# Altium schematic sheet converter.SchDoc
size A3
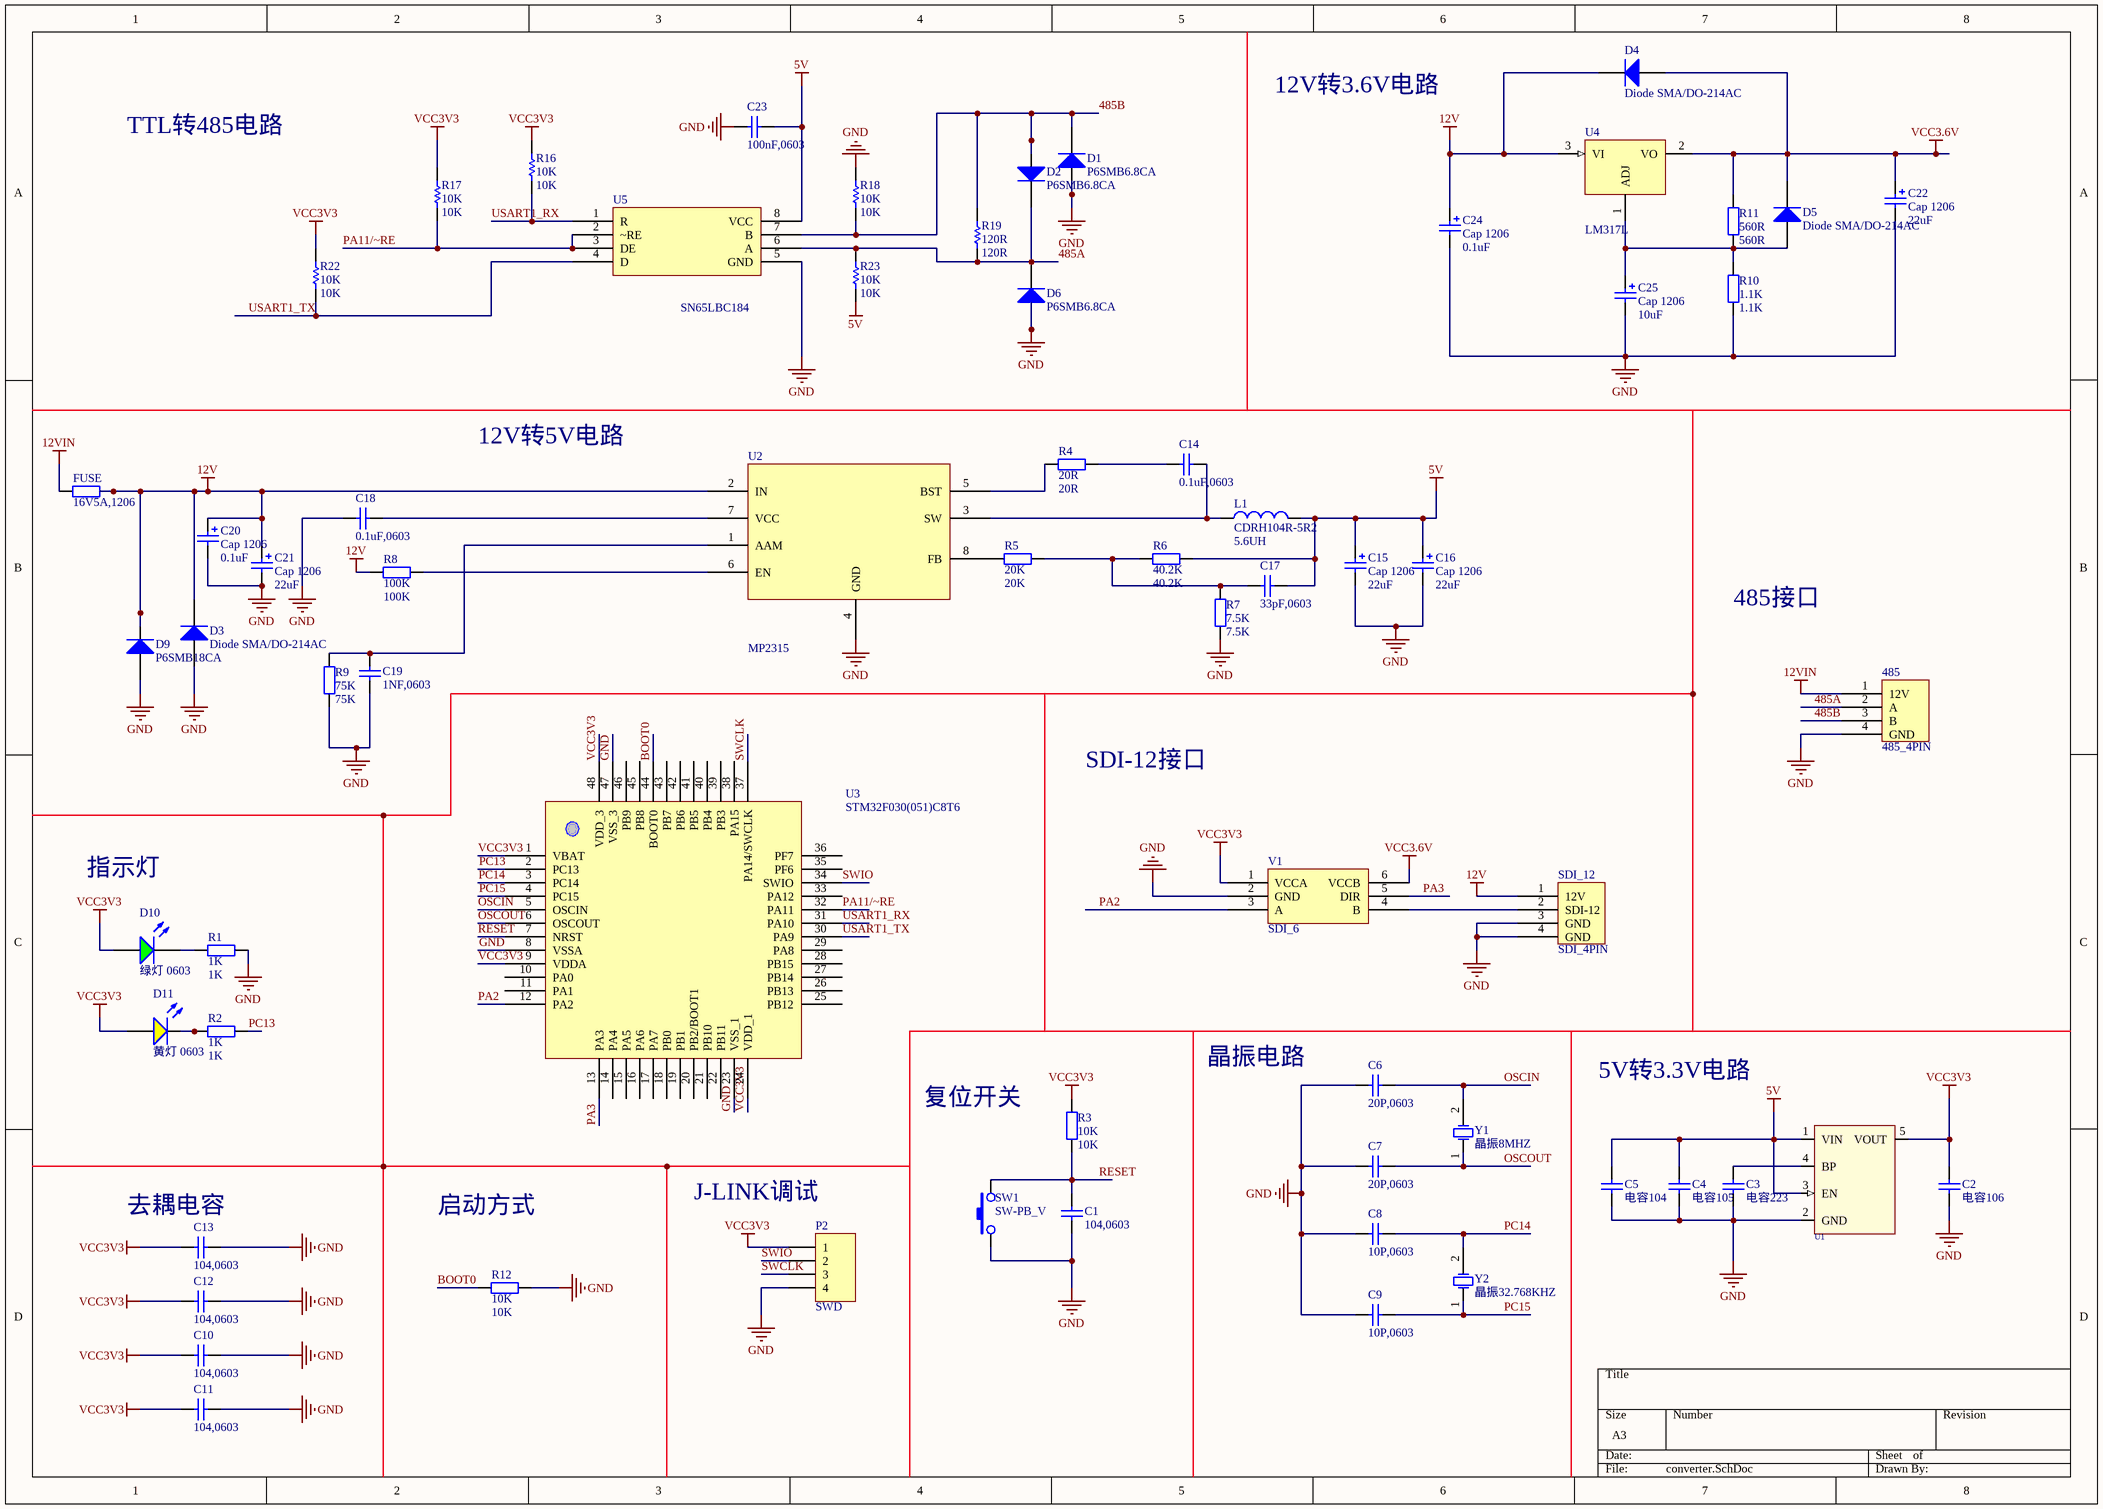
[diagram p0: converter.SchDoc]

## Parts
485  485_4PIN  [HDR1X4]
C1  104,0603  [C0603]
C2  电容106  [C0603]
C3  电容223  [C0603]
C4  电容105  [C0603]
C5  电容104  [C0603]
C6  20P,0603  [C0603]
C7  20P,0603  [C0603]
C8  10P,0603  [C0603]
C9  10P,0603  [C0603]
C10  104,0603  [C0603]
C11  104,0603  [C0603]
C12  104,0603  [C0603]
C13  104,0603  [C0603]
C14  0.1uF,0603  [C0603]
C15  Cap 1206  value 22uF  [LC-1206+]
C16  Cap 1206  value 22uF  [LC-1206+]
C17  33pF,0603  [C0603]
C18  0.1uF,0603  [C0603]
C19  1NF,0603  [C0603]
C20  Cap 1206  value 0.1uF  [LC-1206+]
C21  Cap 1206  value 22uF  [LC-1206+]
C22  Cap 1206  value 22uF  [LC-1206+]
C23  100nF,0603  [C0603]
C24  Cap 1206  value 0.1uF  [LC-1206+]
C25  Cap 1206  value 10uF  [LC-1206+]
D1  P6SMB6.8CA  [LC-SMB(DO-214AA)_S1]
D2  P6SMB6.8CA  [LC-SMB(DO-214AA)_S1]
D3  Diode SMA/DO-214AC  [LC-SMA(DO-214AC)_S1]
D4  Diode SMA/DO-214AC  [LC-SMA(DO-214AC)_S1]
D5  Diode SMA/DO-214AC  [LC-SMA(DO-214AC)_S1]
D6  P6SMB6.8CA  [LC-SMB(DO-214AA)_S1]
D9  P6SMB18CA  [LC-SMB(DO-214AA)_S1]
D10  绿灯 0603  [LC-0603_LED_S1]
D11  黄灯 0603  [LC-0603_LED_S1]
FUSE  16V5A,1206  [LC-1206_R]
L1  CDRH104R-5R2  value 5.6UH  [SMD]
P2  SWD  [HDR1X4]
R1  1K  [LC-0603_R]
R2  1K  [LC-0603_R]
R3  10K  [LC-0603_R]
R4  20R  [LC-0603_R]
R5  20K  [LC-0603_R]
R6  40.2K  [LC-0603_R]
R7  7.5K  [LC-0603_R]
R8  100K  [LC-0603_R]
R9  75K  [LC-0603_R]
R10  1.1K  [LC-0603_R]
R11  560R  [LC-0603_R]
R12  10K  [LC-0603_R]
R16  10K  [LC-0603_R]
R17  10K  [LC-0603_R]
R18  10K  [LC-0603_R]
R19  120R  [LC-0603_R]
R22  10K  [LC-0603_R]
R23  10K  [LC-0603_R]
SDI_12  SDI_4PIN  [HDR1X4]
SW1  SW-PB_V  [3.8*6.1微动开关]
U1  RT9193  [SOT-23-5]  (value not drawn)
U2  MP2315  [TSOT23-8]
U3  STM32F030(051)C8T6  [48P]
U4  LM317L  [TO-92-0.6]
U5  SN65LBC184  [SO8_N]
V1  SDI_6  [SOT23-6_L]
Y1  晶振8MHZ  [LC-SMD-5032_2P]
Y2  晶振32.768KHZ  [LC-SMD-3215_2P FC - 135]

## Nets
5V: C4.2 C5.2 C15.1 C16.1 C17.2 C23.1 L1.2 R6.1 R23.1 U1.1(VIN) U1.3(EN) U5.8(VCC)
12V: C20.1 C21.1 C24.1 D3.2(K) D4.2(K) D9.2(K) FUSE.2 R8.2 SDI_12.1(12V) U2.2(IN) U4.3(VI)
12VIN: 485.1(12V) FUSE.1
GND: 485.4(GND) C1.1 C2.1 C3.1 C4.1 C5.1 C6.1 C7.1 C8.1 C9.1 C10.2 C11.2 C12.2 C13.2 C15.2 C16.2 C18.2 C19.2 C20.2 C21.2 C22.2 C23.2 C24.2 C25.2 D1.1(A) D3.1(A) D6.1(A) D9.1(A) P2.4 R1.2 R7.1 R9.2 R10.2 R12.1 R18.2 SDI_12.3(GND) SDI_12.4(GND) SW1.1 U1.2(GND) U2.4(GND) U3.8(VSSA) U3.23(VSS_1) U3.47(VSS_3) U5.5(GND) V1.2(GND)
VCC3.6V: C22.1 D4.1(A) D5.2(K) R11.1 U4.2(VO) V1.6(VCCB)
VCC3V3: C2.2 C10.1 C11.1 C12.1 C13.1 D10.A D11.A P2.1 R3.2 R16.2 R17.2 R22.2 U1.5(VOUT) U3.1(VBAT) U3.9(VDDA) U3.24(VDD_1) U3.48(VDD_3) V1.1(VCCA)
485A: 485.2(A) D2.2(K) D6.2(K) R19.1 R23.2 U5.6(A)
485B: 485.3(B) D1.2(K) D2.1(A) R18.1 R19.2 U5.7(B)
BOOT0: R12.2 U3.44(BOOT0)
OSCIN: C6.2 U3.5(OSCIN) Y1.2(OSC2)
OSCOUT: C7.2 U3.6(OSCOUT) Y1.1(OSC1)
PA2: U3.12(PA2) V1.3(A)
PA3: U3.13(PA3) V1.5(DIR)
PA11/~RE: R17.1 U3.32(PA11) U5.2(~RE) U5.3(DE)
PC13: R2.2 U3.2(PC13)
PC14: C8.2 U3.3(PC14) Y2.2(OSC2)
PC15: C9.2 U3.4(PC15) Y2.1(OSC1)
RESET: C1.2 R3.1 SW1.2 U3.7(NRST)
SWCLK: P2.3 U3.37(PA14/SWCLK)
SWIO: P2.2 U3.34(SWIO)
USART1_RX: R16.1 U3.31(PA10) U5.1(R)
USART1_TX: R22.1 U3.30(PA9) U5.4(D)
NetC3_2: C3.2 U1.4(BP)
NetC14_1: C14.1 R4.1
NetC14_2: C14.2 L1.1 U2.3(SW)
NetC17_1: C17.1 R5.1 R6.2 R7.2
NetC18_1: C18.1 U2.7(VCC)
NetC19_1: C19.1 R9.1 U2.1(AAM)
NetC25_1: C25.1 D5.1(A) R10.1 R11.2 U4.1(ADJ)
NetD10_K: D10.K R1.1
NetD11_K: D11.K R2.1
NetR4_2: R4.2 U2.5(BST)
NetR5_2: R5.2 U2.8(FB)
NetR8_1: R8.1 U2.6(EN)
NetSDI_12_2: SDI_12.2(SDI-12) V1.4(B)

Not connected (* = marked no-connect by the designer): U3 10(PA0) 11(PA1) 14(PA4) 15(PA5) 16(PA6) 17(PA7) 18(PB0) 19(PB1) 20(PB2/BOOT1) 21(PB10) 22(PB11) 25(PB12) 26(PB13) 27(PB14) 28(PB15) 29(PA8) 33(PA12) 35(PF6) 36(PF7) 38(PA15) 39(PB3) 40(PB4) 41(PB5) 42(PB6) 43(PB7) 45(PB8) 46(PB9)

## Notes on the sheet
- 12V转3.6V电路
- TTL转485电路
- 12V转5V电路
- 485接口
- SDI-12接口
- 指示灯
- 复位开关
- 晶振电路
- 5V转3.3V电路
- (near C13) 去耦电容
- 启动方式
- (near P2) J-LINK调试

## Library data of the parts
C1-C14 C17-C19 C23 = Cap: Capacitor; Value: 104; Published: 8-Jun-2000; LatestRevisionDate: 17-Jul-2002; LatestRevisionNote: Re-released for DXP Platform.; Publisher: Altium Limited
C15 C16 C20-C22 C24 C25 = Cap Pol2: Polarized Capacitor (Axial); Published: 8-Jun-2000; LatestRevisionDate: 17-Jul-2002; LatestRevisionNote: Re-released for DXP Platform.; PackageReference: POLAR0.8; Publisher: Altium Limited; PackageDescription: Polarized Capacitor; 2 Leads
D1 D2 D6 D9 = SMB/DO-214AA P6SMB6.8CA: TVS; ComponentLink1Description: 供应商链接; ComponentLink1URL: http://www.szlcsc.com/product/details_79530.html; Package: SMB/DO-214AA; Supplier: LC; SuppliersPartNumber: C78395
D3 = Diode 1N4007: 1 Amp General Purpose Rectifier; Published: 8-Jun-2000; LatestRevisionDate: 17-Jul-2002; LatestRevisionNote: Re-released for DXP Platform.; DatasheetVersion: 1998; PackageVersion: Aug-1999; PackageReference: DO-41; Publisher: Altium Limited; PackageDescription: Diode, Axial; Body 5.2 x 2.7 mm (LxDia. max), Lead Dia. 0.86 mm (max); Code_JEDEC: DO-204-AL; ComponentLink1Description: Manufacturer Link; ComponentLink1URL: http://www.fairchildsemi.com/; ComponentLink2Description: Datasheet; ComponentLink2URL: http://www.fairchildsemi.com/ds/1N%2F1N4001.pdf
D4 D5 = Diode 1N4001: 1 Amp General Purpose Rectifier; Published: 8-Jun-2000; LatestRevisionDate: 17-Jul-2002; LatestRevisionNote: Re-released for DXP Platform.; DatasheetVersion: 1998; PackageVersion: Aug-1999; PackageReference: DO-41; Publisher: Altium Limited; PackageDescription: Diode, Axial; Body 5.2 x 2.7 mm (LxDia. max), Lead Dia. 0.86 mm (max); Code_JEDEC: DO-204-AL; ComponentLink1Description: Manufacturer Link; ComponentLink1URL: http://www.fairchildsemi.com/; ComponentLink2Description: Datasheet; ComponentLink2URL: http://www.fairchildsemi.com/ds/1N%2F1N4001.pdf
D10 = 0603 绿灯: 发光二极管; ComponentLink1Description: 供应商链接; ComponentLink1URL: http://www.szlcsc.com/product/details_73152.html; Package: 0603; Supplier: LC; SuppliersPartNumber: C72043
D11 = 0603 黄灯: 发光二极管; ComponentLink1Description: 供应商链接; ComponentLink1URL: http://www.szlcsc.com/product/details_73147.html; Package: 0603; Supplier: LC; SuppliersPartNumber: C72038
FUSE = 1206 180Ω (1800) 1%: 贴片电阻; ComponentLink1Description: 供应商链接; ComponentLink1URL: http://www.szlcsc.com/product/details_18612.html; Package: 1206; Supplier: LC; SuppliersPartNumber: C17924
L1 = Inductor: Code_IEC: 1005; Published: 8-Jun-2000; LatestRevisionDate: 29-May-2009; LatestRevisionNote: IPC-7351 Footprint Added.; PackageReference: 0402-A; Publisher: Altium Limited; PackageDescription: Chip Inductor; Code_JEITA: 0402
P2 = Header 4: Header, 4-Pin; LatestRevisionDate: 17-Jul-2002; LatestRevisionNote: Re-released for DXP Platform.; Publisher: Altium Limited
R1-R12 = Res2: Resistor; Published: 8-Jun-2000; LatestRevisionDate: 17-Jul-2002; LatestRevisionNote: Re-released for DXP Platform.; PackageReference: AXIAL-0.4; Publisher: Altium Limited; PackageDescription: Axial Device, Thru-Hole; 2 Leads; 0.4 in Pin Spacing
  R1 R2: Value: 1K
  R3 R12: Value: 10K
  R4: Value: 20R
  R5: Value: 20K
  R6: Value: 40.2K
  R7: Value: 7.5K
  R8: Value: 100K
  R9: Value: 75K
  R10: Value: 1.1K
  R11: Value: 560R
R16-R19 R22 R23 = Res Semi: Semiconductor Resistor; Published: 8-Jun-2000; LatestRevisionDate: 17-Jul-2002; LatestRevisionNote: Re-released for DXP Platform.; PackageReference: AXIAL-0.5; Publisher: Altium Limited; PackageDescription: Axial Device, Thru-Hole; 2 Leads; 0.5 in Pin Spacing
  R16-R18 R22 R23: Value: 10K
  R19: Value: 120R
SW1 = SW-PB_V: SWITCH
U1 = RT9193X_5P: ICA_MFR_NAME: RICHTEK; ICA_PARTNUM: $$2191094$$RT9193-15CU5; Part Number: TMP-13
U3 = STM32F030C8T6
U4 = LM317L: Linear Regulator
U5 = SN75LBC184
Y1 Y2 = SMD-5032_2P 11.0592MHZ 20PF 20PPM: 贴片晶振; ComponentLink1Description: 供应商链接; ComponentLink1URL: http://www.szlcsc.com/product/details_53039.html; Package: SMD-5032_2P; Supplier: LC; SuppliersPartNumber: C52026